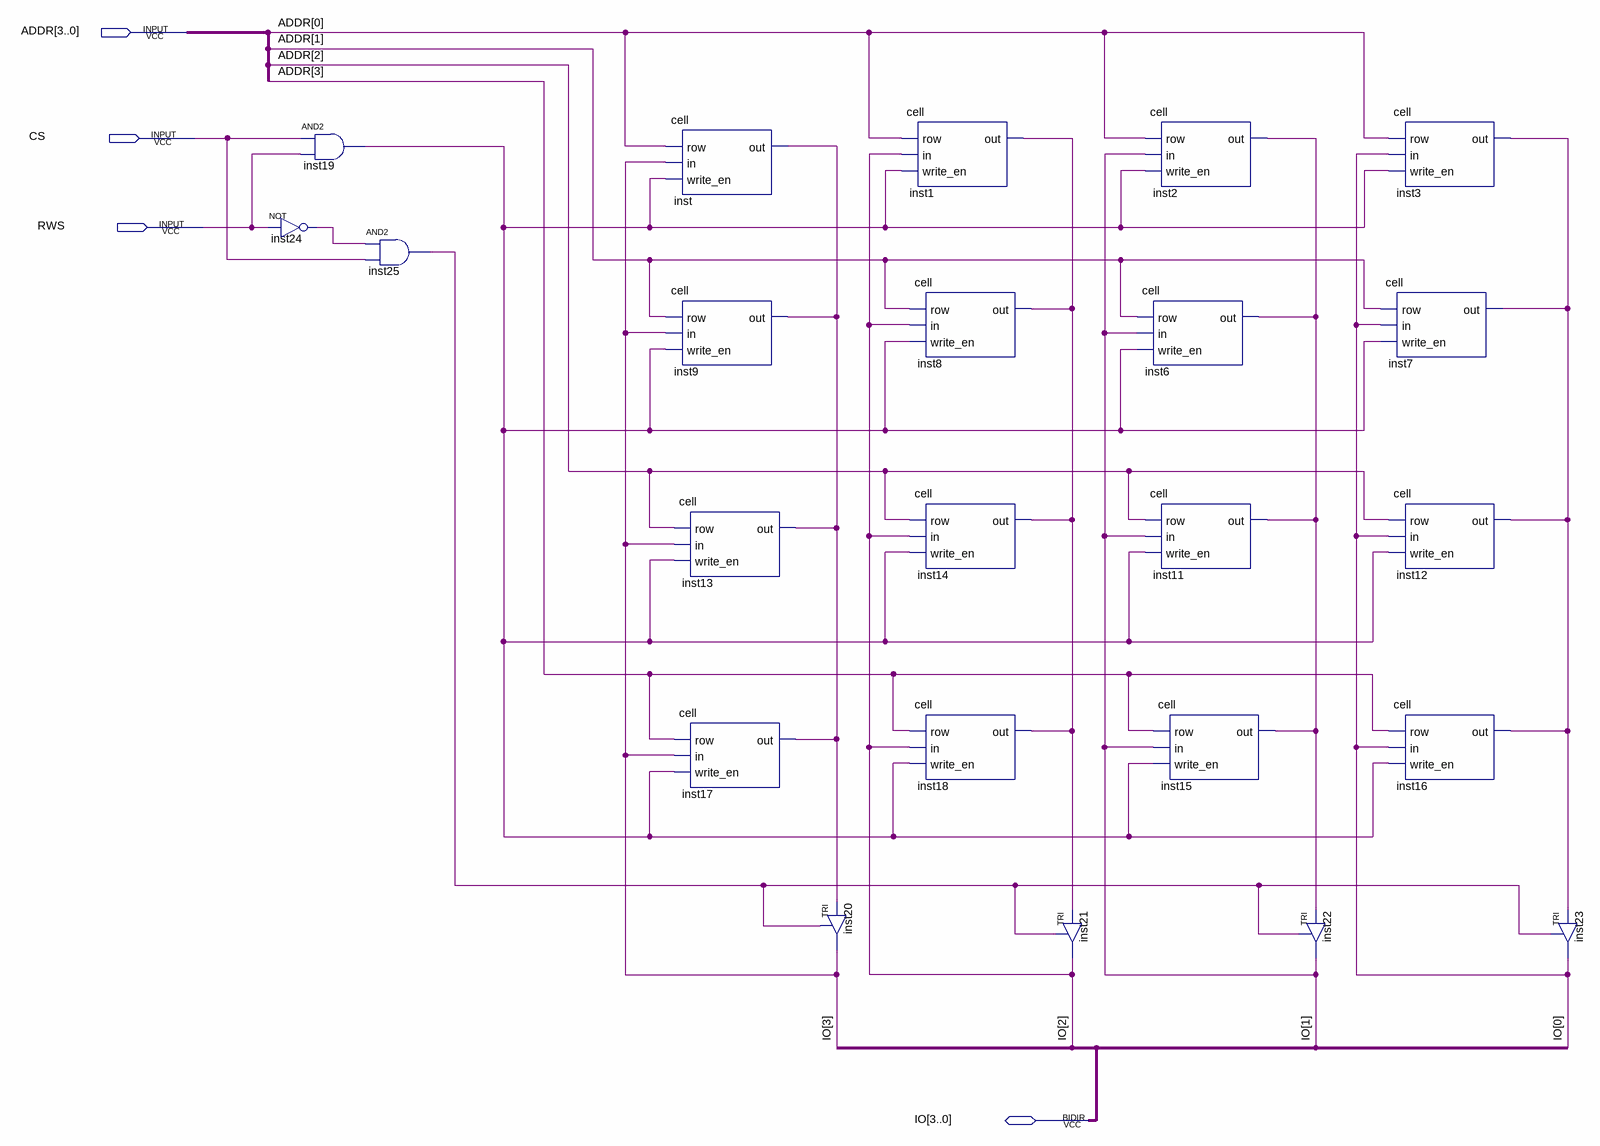
[diagram p0: schematic sheet]
// Quartus schematic RAM4x4.bdf as structural Verilog: 23 symbols, 4 pins
module RAM4x4 (
  input  [3:0] ADDR,
  input  CS,
  input  RWS,
  inout  [3:0] IO
);

  wire inst1_out, inst2_out, inst3_out, inst19_out, inst24_out, inst25_out, inst_out;

  not inst24 (inst24_out, RWS);
  and inst19 (inst19_out, CS, RWS);
  and inst25 (inst25_out, inst24_out, CS);
  \cell  inst (.row(ADDR[0]), .in(IO[3]), .write_en(inst19_out), .out(inst_out));
  \cell  inst9 (.row(ADDR[1]), .in(IO[3]), .write_en(inst19_out), .out(inst_out));
  \cell  inst13 (.row(ADDR[2]), .in(IO[3]), .write_en(inst19_out), .out(inst_out));
  \cell  inst17 (.row(ADDR[3]), .in(IO[3]), .write_en(inst19_out), .out(inst_out));
  TRI inst20 (.IN(inst_out), .OE(inst25_out), .OUT(IO[3]));
  \cell  inst1 (.row(ADDR[0]), .in(IO[2]), .write_en(inst19_out), .out(inst1_out));
  \cell  inst8 (.row(ADDR[1]), .in(IO[2]), .write_en(inst19_out), .out(inst1_out));
  \cell  inst14 (.row(ADDR[2]), .in(IO[2]), .write_en(inst19_out), .out(inst1_out));
  \cell  inst18 (.row(ADDR[3]), .in(IO[2]), .write_en(inst19_out), .out(inst1_out));
  TRI inst21 (.IN(inst1_out), .OE(inst25_out), .OUT(IO[2]));
  \cell  inst2 (.row(ADDR[0]), .in(IO[1]), .write_en(inst19_out), .out(inst2_out));
  \cell  inst6 (.row(ADDR[1]), .in(IO[1]), .write_en(inst19_out), .out(inst2_out));
  \cell  inst11 (.row(ADDR[2]), .in(IO[1]), .write_en(inst19_out), .out(inst2_out));
  \cell  inst15 (.row(ADDR[3]), .in(IO[1]), .write_en(inst19_out), .out(inst2_out));
  TRI inst22 (.IN(inst2_out), .OE(inst25_out), .OUT(IO[1]));
  \cell  inst3 (.row(ADDR[0]), .in(IO[0]), .write_en(inst19_out), .out(inst3_out));
  \cell  inst7 (.row(ADDR[1]), .in(IO[0]), .write_en(inst19_out), .out(inst3_out));
  \cell  inst12 (.row(ADDR[2]), .in(IO[0]), .write_en(inst19_out), .out(inst3_out));
  \cell  inst16 (.row(ADDR[3]), .in(IO[0]), .write_en(inst19_out), .out(inst3_out));
  TRI inst23 (.IN(inst3_out), .OE(inst25_out), .OUT(IO[0]));
endmodule
